# EAGLE schematic Project_2 (EAGLE 9.5.1)
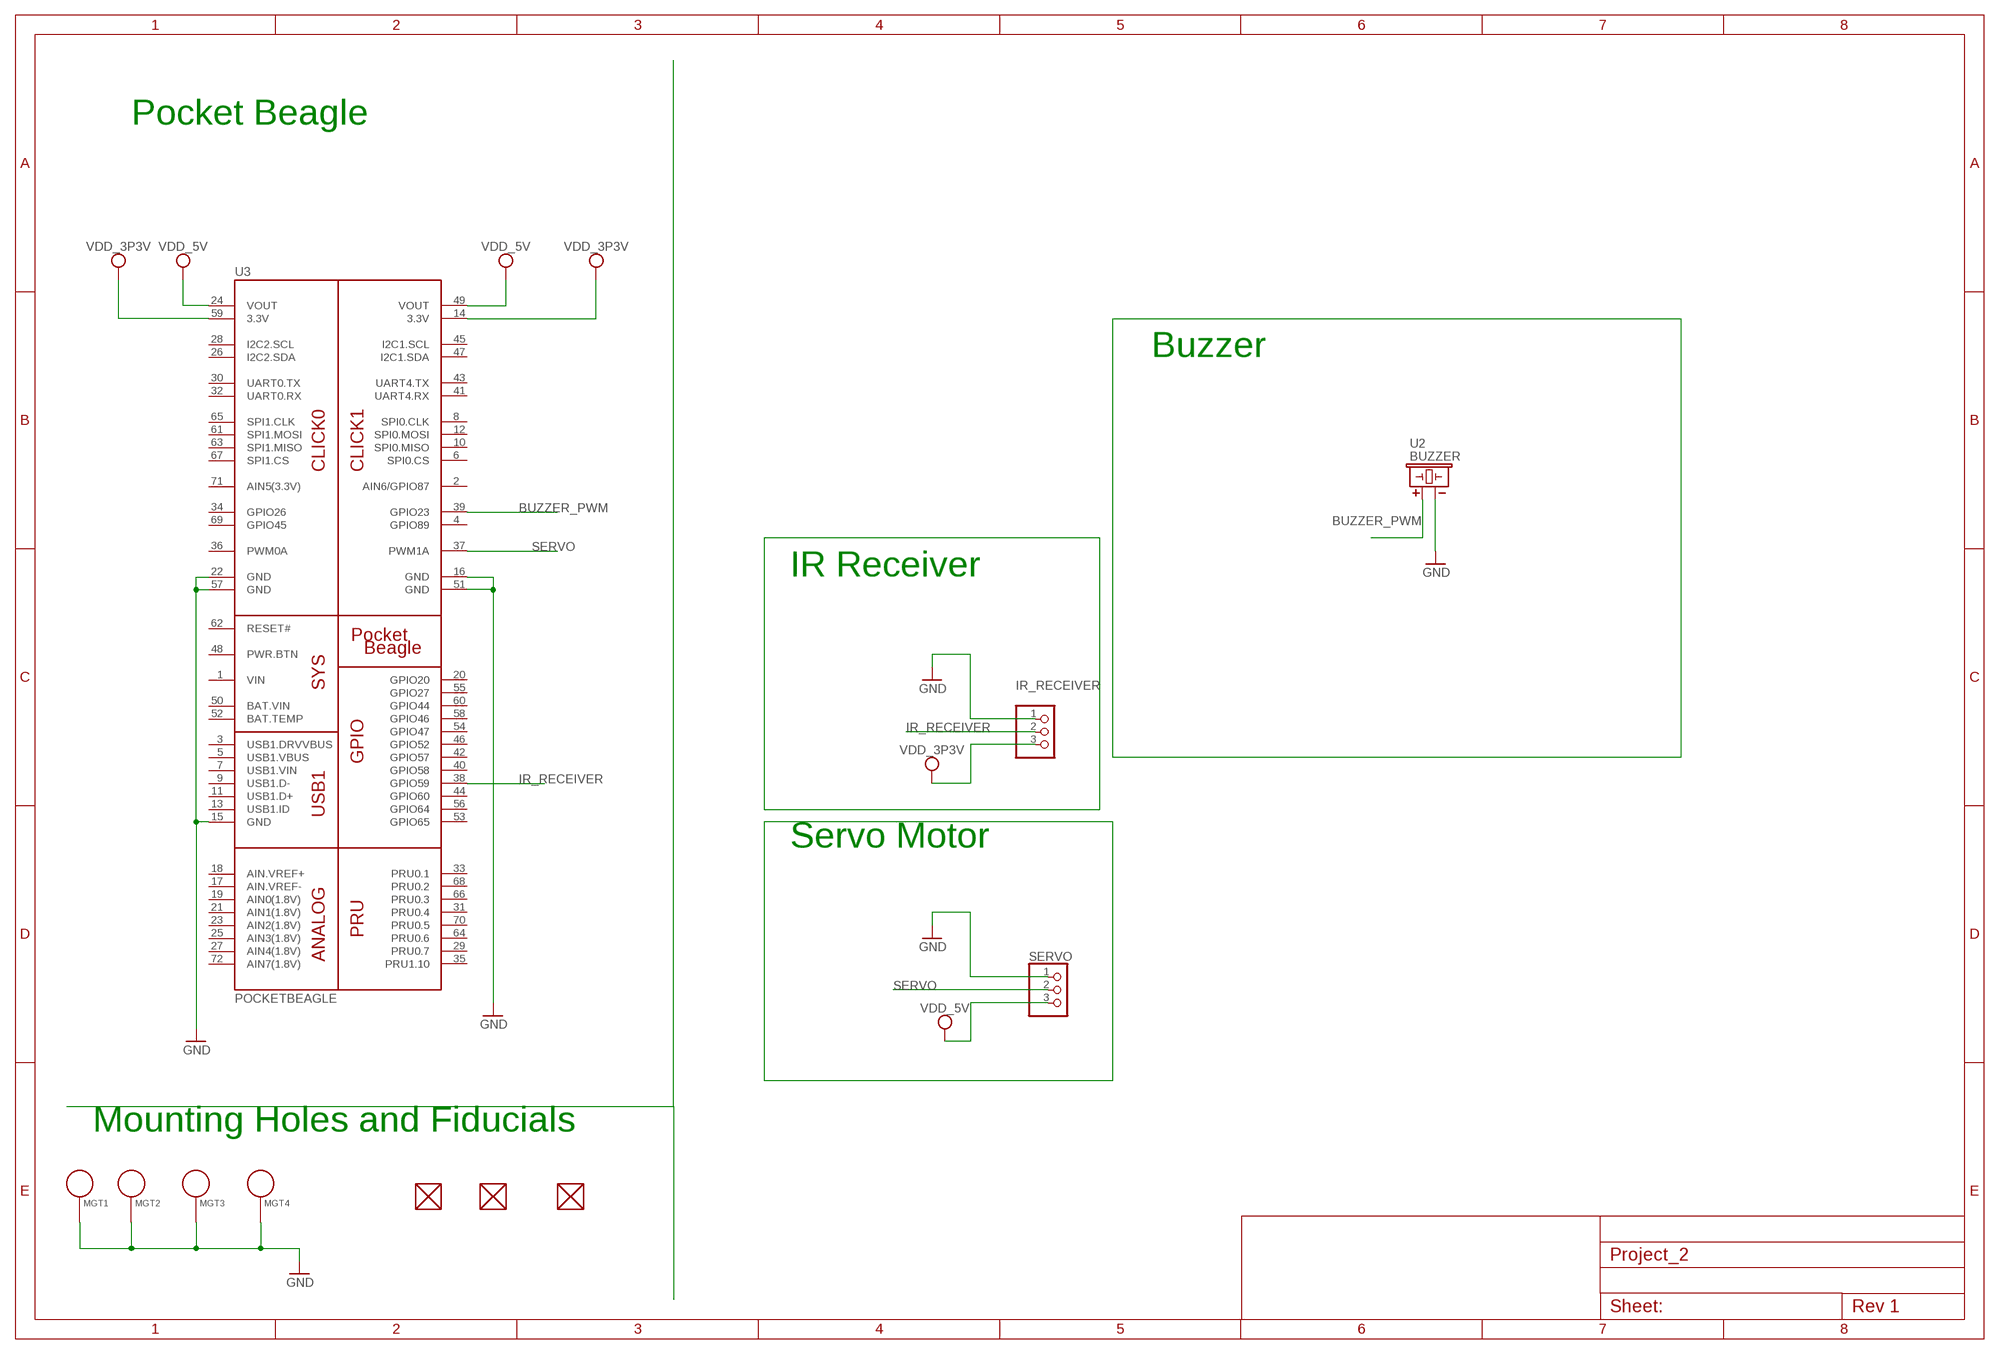
[diagram p0: schematic, sheet 1]

## Parts
FUD1  FIDUCIAL  [FIDUCIAL_40MIL]
FUD2  FIDUCIAL  [FIDUCIAL_40MIL]
FUD3  FIDUCIAL  [FIDUCIAL_40MIL]
IR_RECEIVER  PINHD-1X3  [1X03]
MGT1  MOUNTING_HOLE  [MOUNTING_HOLE]
MGT2  MOUNTING_HOLE  [MOUNTING_HOLE]
MGT3  MOUNTING_HOLE  [MOUNTING_HOLE]
MGT4  MOUNTING_HOLE  [MOUNTING_HOLE]
SERVO  PINHD-1X3  [1X03]
U2  BUZZER  [BUZZER_6.5MM]
U3  POCKETBEAGLE  [POCKETBEAGLE]

## Nets
BUZZER_PWM: U2.+ U3.39(GPIO23)
GND: IR_RECEIVER.1 MGT1.P$1 MGT2.P$1 MGT3.P$1 MGT4.P$1 SERVO.1 U2.- U3.15(GND) U3.16(GND) U3.22(GND) U3.51(GND) U3.57(GND)
IR_RECEIVER: IR_RECEIVER.2 U3.38(GPIO59)
SERVO: SERVO.2 U3.37(PWM1A)
VDD_3P3V: IR_RECEIVER.3 U3.14(3.3V) U3.59(3.3V)
VDD_5V: SERVO.3 U3.24(VOUT) U3.49(VOUT)
Unconnected: FUD1.P$1 FUD2.P$1 FUD3.P$1 U3.2(AIN6/GPIO87) U3.3(USB1.DRVVBUS) U3.4(GPIO89) U3.5(USB1.VBUS) U3.6(SPI0.CS) U3.7(USB1.VIN) U3.8(SPI0.CLK) U3.9(USB1.D-) U3.10(SPI0.MISO) U3.11(USB1.D+) U3.12(SPI0.MOSI) U3.13(USB1.ID) U3.17(AIN.VREF-) U3.18(AIN.VREF+) U3.19(AIN0(1.8V)) U3.20(GPIO20) U3.21(AIN1(1.8V)) U3.23(AIN2(1.8V)) U3.25(AIN3(1.8V)) U3.26(I2C2.SDA) U3.27(AIN4(1.8V)) U3.28(I2C2.SCL) U3.29(PRU0.7) U3.30(UART0.TX) U3.31(PRU0.4) U3.32(UART0.RX) U3.33(PRU0.1) U3.34(GPIO26) U3.35(PRU1.10) U3.36(PWM0A) U3.40(GPIO58) U3.41(UART4.RX) U3.42(GPIO57) U3.43(UART4.TX) U3.44(GPIO60) U3.45(I2C1.SCL) U3.46(GPIO52) U3.47(I2C1.SDA) U3.48(PWR.BTN) U3.52(BAT.TEMP) U3.53(GPIO65) U3.54(GPIO47) U3.55(GPIO27) U3.56(GPIO64) U3.58(GPIO46) U3.60(GPIO44) U3.61(SPI1.MOSI) U3.62(RESET#) U3.63(SPI1.MISO) U3.64(PRU0.6) U3.65(SPI1.CLK) U3.66(PRU0.3) U3.67(SPI1.CS) U3.68(PRU0.2) U3.69(GPIO45) U3.70(PRU0.5) U3.71(AIN5(3.3V)) U3.72(AIN7(1.8V))

## Notes on the sheet
- Pocket Beagle
- Buzzer
- IR Receiver
- Servo Motor
- Mounting Holes and Fiducials

## Power pins joined to a net without a drawn wire
BAT.VIN: U3.50(BAT.VIN)
VIN: U3.1(VIN)

## Library data of the parts
FUD1-FUD3 = ENGI301:FIDUCIAL
IR_RECEIVER SERVO = pinhead:PINHD-1X3: PIN HEADER
MGT1-MGT4 = ENGI301:MOUNTING_HOLE: Chassis Mounting Hole w/GND connection ability
U2 = ENGI301:BUZZER: CEM-1203 Buzzer
U3 = ENGI301:POCKETBEAGLE